# Altium schematic sheet Display.SchDoc: Soldeerstation
size A4; DrawnBy: Miguel Nunez; DocumentNumber: 2022/001; Revision: v1; SheetNumber: 2; SheetTotal: 6
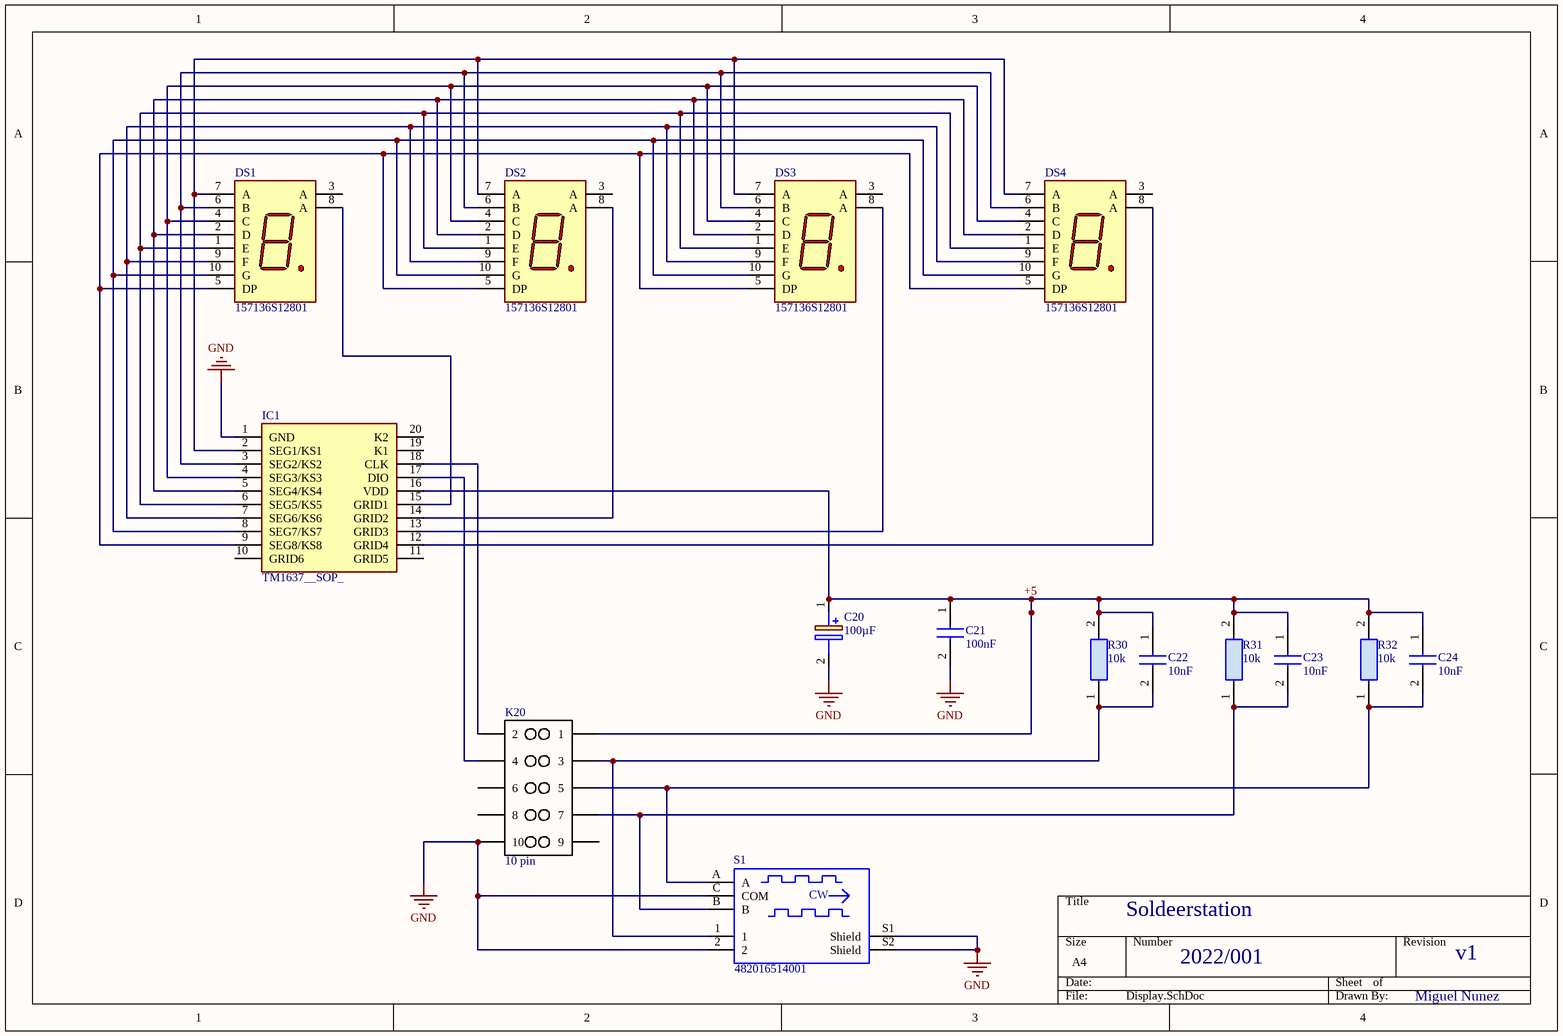
[diagram p0: Display.SchDoc]

## Parts
C20  100µF  [WCAP-AT1H_D10H16]
C21  100nF  [WCAP-CSGP_0805_L2W1.25H0.8_Reflow]
C22  10nF  [CAPC2012X100N]
C23  10nF  [CAPC2012X100N]
C24  10nF  [CAPC2012X100N]
DS1  157136S12801  [WL-T7DS_L17.5W12.4H7]
DS2  157136S12801  [WL-T7DS_L17.5W12.4H7]
DS3  157136S12801  [WL-T7DS_L17.5W12.4H7]
DS4  157136S12801  [WL-T7DS_L17.5W12.4H7]
IC1  TM1637__SOP_  [SOIC127P1045X280-20N]
K20  10 pin  [215307-5_TYC]
R30  10k  [RESC2012X60N]
R31  10k  [RESC2012X60N]
R32  10k  [RESC2012X60N]
S1  482016514001  [4820xx514001]

## Nets
+5: C20.1(+) C21.1 C22.1 C23.1 C24.1 IC1.16(VDD) K20.1 R30.2 R31.2 R32.2
GND: C20.2(-) C21.2 IC1.1(GND) K20.10 S1.2 S1.C(COM) S1.S1(Shield) S1.S2(Shield)
NetC22_2: C22.2 K20.3 R30.1 S1.1
NetC23_2: C23.2 K20.7 R31.1 S1.B
NetC24_2: C24.2 K20.5 R32.1 S1.A
NetDS1_1: DS1.1(E) DS2.1(E) DS3.1(E) DS4.1(E) IC1.6(SEG5/KS5)
NetDS1_2: DS1.2(D) DS2.2(D) DS3.2(D) DS4.2(D) IC1.5(SEG4/KS4)
NetDS1_4: DS1.4(C) DS2.4(C) DS3.4(C) DS4.4(C) IC1.4(SEG3/KS3)
NetDS1_5: DS1.5(DP) DS2.5(DP) DS3.5(DP) DS4.5(DP) IC1.9(SEG8/KS8)
NetDS1_6: DS1.6(B) DS2.6(B) DS3.6(B) DS4.6(B) IC1.3(SEG2/KS2)
NetDS1_7: DS1.7(A) DS2.7(A) DS3.7(A) DS4.7(A) IC1.2(SEG1/KS1)
NetDS1_8: DS1.8(A) IC1.15(GRID1)
NetDS1_9: DS1.9(F) DS2.9(F) DS3.9(F) DS4.9(F) IC1.7(SEG6/KS6)
NetDS1_10: DS1.10(G) DS2.10(G) DS3.10(G) DS4.10(G) IC1.8(SEG7/KS7)
NetDS2_8: DS2.8(A) IC1.14(GRID2)
NetDS3_8: DS3.8(A) IC1.13(GRID3)
NetDS4_8: DS4.8(A) IC1.12(GRID4)
NetIC1_17: IC1.17(DIO) K20.4
NetIC1_18: IC1.18(CLK) K20.2

Not connected (* = marked no-connect by the designer): DS1 3(A); DS2 3(A); DS3 3(A); DS4 3(A); IC1 10(GRID6) 11(GRID5) 19(K1) 20(K2); K20 6 8 9

## Notes on the sheet
- (in symbol 482016514001) CW

## Library data of the parts
C20 = ELCAP 100µF: Capacitor Polarised 100µF Wurth 860241181006; Manufacturer_Name: Wurth Elektronik; Datasheet Link: https://www.we-online.de/katalog/datasheet/860241181006.pdf; Height: 27mm; Manufacturer_Part_Number: 860241181006
C21 = CAP 0.1µF (100nF): Capacitor C0805C104K8RACAUTO; Manufacturer_Name: Kemet; Datasheet Link: https://ad.componentsearchengine.com/Datasheets/2/C0805C104K8RACAUTO.pdf; Height: 0.88mm; Manufacturer_Part_Number: C0805C104K8RACAUTO
C22-C24 = CAP 0.01µF (10nF): Capacitor C0805C103K1HACAUTO; Manufacturer_Name: Kemet; Datasheet Link: https://componentsearchengine.com//C0805C103K1HACAUTO.pdf; Height: 1mm; Mouser2 Part Number: 80-C0805C103K1HAUTO; Mouser2 Price/Stock: https://www.mouser.com/Search/Refine.aspx?Keyword=80-C0805C103K1HAUTO; Manufacturer_Part_Number: C0805C103K1HACAUTO
DS1-DS4 = 157136S12801: WL-T7DS 7 Segments Display THT Single Digit, Common Anode, 0.52" / 13.2mm, 38mcd, 2V, Super Red; Manufacturer: Wurth Elektronik; Circuitry: Common Anode; Width: 12.4mm; Mounting Technology: THT; Display Height: 0.52" / 13.2mm; Operating Temperature max.: 85C; Packaging: Tube; Luminous Intensity: 38mcd; Length: 17.5mm; ComponentLink2Description: Datasheet; Forward Voltage: 2V; ComponentLink1Description: Manufacturer Link; Manufacturer Part Number: 157136S12801; Height: 7mm; ComponentLink1URL: http://www.we-online.de; Emitting Color: Super Red; ComponentLink2URL: https://www.we-online.com/catalog/datasheet/157136S12801.pdf; Operating Temperature min.: -40C
IC1 = TM1637__SOP_: Integrated Circuit; Manufacturer_Name: TITAN MICRO ELECTRONICS; Manufacturer_Part_Number: TM1637 (SOP); Datasheet Link: https://www.mcielectronics.cl/website_MCI/static/documents/Datasheet_TM1637.pdf; Height: 2.8mm
K20 = Header 2x5: Header, 5-Pin, Dual row; LatestRevisionDate: 17-Jul-2002; LatestRevisionNote: Re-released for DXP Platform.; Publisher: Altium Limited
R30-R32 = RES 10k 0805: 10k SMD 0805  CR0805-FX-1002ELF; Manufacturer_Name: Bourns; Datasheet Link: https://componentsearchengine.com//CR0805-FX-1002ELF.pdf; Height: 0.6mm; Mouser2 Part Number: 652-CR0805FX-1002ELF; Mouser2 Price/Stock: https://www.mouser.com/Search/Refine.aspx?Keyword=652-CR0805FX-1002ELF; Manufacturer_Part_Number: CR0805-FX-1002ELF
S1 = 482016514001: WS-ENTV Mechanical Incremental Encoder Switch, Metal Shaft with bushing, 15Pulse/360deg, 30positions, 10mA; Manufacturer: Wurth Elektronik; Electrical Life Switch: 20000Cycles; Electrical Life Encoder: 15000Cycles; Insulation Resistance: 100MOhm; Operation Force: 600g; ComponentLink1Description: Manufacturer; ComponentLink1URL: http://www.we-online.de; ComponentLink2Description: Datasheet; ComponentLink2URL: https://www.we-online.com/catalog/datasheet/482016514001.pdf; Mounting Technology: THT; Manufacturer Part Number: 482016514001; Published Date: May 2021; Detent: 30positions; Operating Temperature: -40 to +85degC; Packaging: Tray; Resolution: 15Pulse/360deg; Rated Current: 10mA; Size: L13.75W11.7H26.6